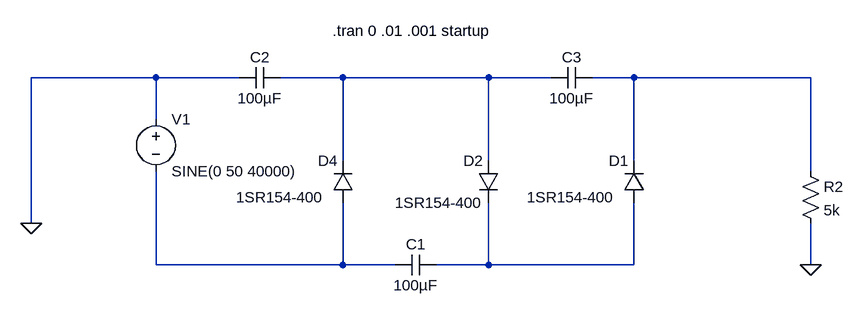
[diagram p0: schematic voltageDoubler.asc]
voltageDoubler.asc, the LTspice schematic file:
Version 4
SHEET 1 880 680
WIRE -400 -48 -592 -48
WIRE -272 -48 -400 -48
WIRE -112 -48 -208 -48
WIRE 112 -48 -112 -48
WIRE 208 -48 112 -48
WIRE 336 -48 272 -48
WIRE 608 -48 336 -48
WIRE -400 16 -400 -48
WIRE -112 80 -112 -48
WIRE 112 80 112 -48
WIRE 336 80 336 -48
WIRE 608 96 608 -48
WIRE -592 176 -592 -48
WIRE -400 240 -400 96
WIRE -112 240 -112 144
WIRE -112 240 -400 240
WIRE -32 240 -112 240
WIRE 112 240 112 144
WIRE 112 240 32 240
WIRE 336 240 336 144
WIRE 336 240 112 240
WIRE 608 240 608 176
FLAG 608 240 0
FLAG -592 176 0
SYMBOL diode -96 144 R180
WINDOW 0 24 64 Left 2
WINDOW 3 45 8 Left 2
SYMATTR InstName D4
SYMATTR Value 1SR154-400
SYMBOL voltage -400 0 R0
WINDOW 123 0 0 Left 2
WINDOW 39 0 0 Left 2
SYMATTR InstName V1
SYMATTR Value SINE(0 50 40000)
SYMBOL res 592 80 R0
SYMATTR InstName R2
SYMATTR Value 5k
SYMATTR SpiceLine tol=5%
SYMBOL cap -208 -64 R90
WINDOW 0 0 32 VBottom 2
WINDOW 3 32 32 VTop 2
SYMATTR InstName C2
SYMATTR Value 100µF
SYMBOL cap 32 224 R90
WINDOW 0 0 32 VBottom 2
WINDOW 3 32 32 VTop 2
SYMATTR InstName C1
SYMATTR Value 100µF
SYMBOL cap 272 -64 R90
WINDOW 0 0 32 VBottom 2
WINDOW 3 32 32 VTop 2
SYMATTR InstName C3
SYMATTR Value 100µF
SYMBOL diode 352 144 R180
WINDOW 0 24 64 Left 2
WINDOW 3 45 8 Left 2
SYMATTR InstName D1
SYMATTR Value 1SR154-400
SYMBOL diode 128 80 M0
SYMATTR InstName D2
SYMATTR Value 1SR154-400
TEXT -128 -120 Left 2 !.tran 0 .01 .001 startup

The netlist it stands for:
* voltageDoubler.asc
D4 N003 N001 1SR154-400
V1 0 N003 SINE(0 50 40000)
R2 N002 0 5k tol=5%
C2 N001 0 100µF
C1 N004 N003 100µF
C3 N002 N001 100µF
D1 N004 N002 1SR154-400
D2 N001 N004 1SR154-400
.model D D
.lib standard.dio
.tran 0 .01 .001 startup
.backanno
.end